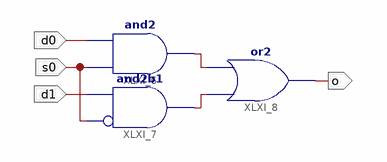
[diagram p0: schematic sheet 1]
// Xilinx ISE schematic m2_1.sch (spartan3e) as structural Verilog: 3 symbols, 4 ports
module m2_1 (
  input  s0,
  input  d0,
  input  d1,
  output o
);

  wire XLXN_21, XLXN_22;

  and XLXI_6 (XLXN_21, s0, d0);
  and XLXI_7 (XLXN_22, ~s0, d1);  // and2b1
  or XLXI_8 (o, XLXN_22, XLXN_21);
endmodule
